# EAGLE schematic SwerveCANConnectorGood v2 (EAGLE 9.7.0)
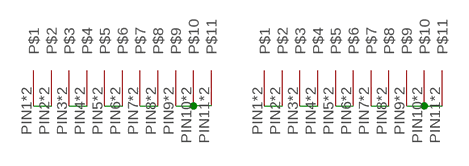
[diagram p0: schematic, sheet 1]

## Parts
U$1  WEIDM-1825890000  [WEIDM-1825890000]
U$2  WEIDM-1825890000  [WEIDM-1825890000]

## Nets
N$1: U$1.PIN1 U$1.PIN2 U$1.PIN12 U$1.PIN13
N$2: U$1.PIN3 U$1.PIN4 U$1.PIN14 U$1.PIN15
N$3: U$1.PIN5 U$1.PIN6 U$1.PIN16 U$1.PIN17
N$4: U$1.PIN7 U$1.PIN8 U$1.PIN18 U$1.PIN19
N$5: U$1.PIN9 U$1.PIN10 U$1.PIN11 U$1.PIN20 U$1.PIN21 U$1.PIN22
N$6: U$2.PIN1 U$2.PIN2 U$2.PIN12 U$2.PIN13
N$7: U$2.PIN3 U$2.PIN4 U$2.PIN14 U$2.PIN15
N$8: U$2.PIN5 U$2.PIN6 U$2.PIN16 U$2.PIN17
N$9: U$2.PIN7 U$2.PIN8 U$2.PIN18 U$2.PIN19
N$10: U$2.PIN9 U$2.PIN10 U$2.PIN11 U$2.PIN20 U$2.PIN21 U$2.PIN22

## Library data of the parts
U$1 U$2 = StealthEE:WEIDM-1825890000